# Altium schematic sheet main.SchDoc
size A4
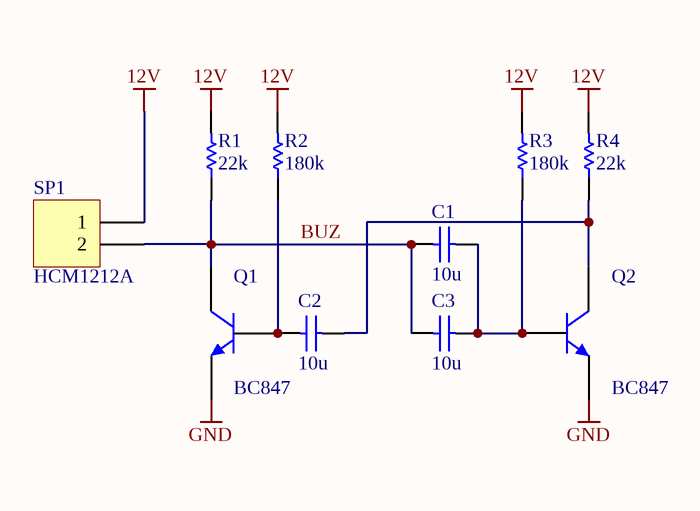
[diagram p0: main.SchDoc]

## Parts
C1  10u  [C1210-2.5MM]
C2  10u  [C1210-2.5MM]
C3  10u  [C1210-2.5MM]
Q1  BC847  [SOT-23]
Q2  BC847  [SOT-23]
R1  22k  [R0805]
R2  180k  [R1206]
R3  180k  [R1206]
R4  22k  [R0805]
SP1  HCM1212A  [BUZZER]  (no BOM)

## Nets
12V: R1.2 R2.2 R3.2 R4.2 SP1.1
GND: Q1.2(E) Q2.2(E)
BUZ: C1.2 C3.2 Q1.3(C) R1.1 SP1.2
NetC1_1: C1.1 C3.1 Q2.1(B) R3.1
NetC2_1: C2.1 Q2.3(C) R4.1
NetC2_2: C2.2 Q1.1(B) R2.1

## Library data of the parts
C1-C3 = Cap
Q1 Q2 = MMBT2222ALT1G: P/N: MJD122
R1-R4 = Res1
SP1 = Header 2: HCM1212X / 12V, 2.3Hz, 85dB/10cm, with gen.